# Altium schematic sheet MainBoard_V1p0_ANA.SchDoc
size A4; SheetNumber: 4; SheetTotal: 8
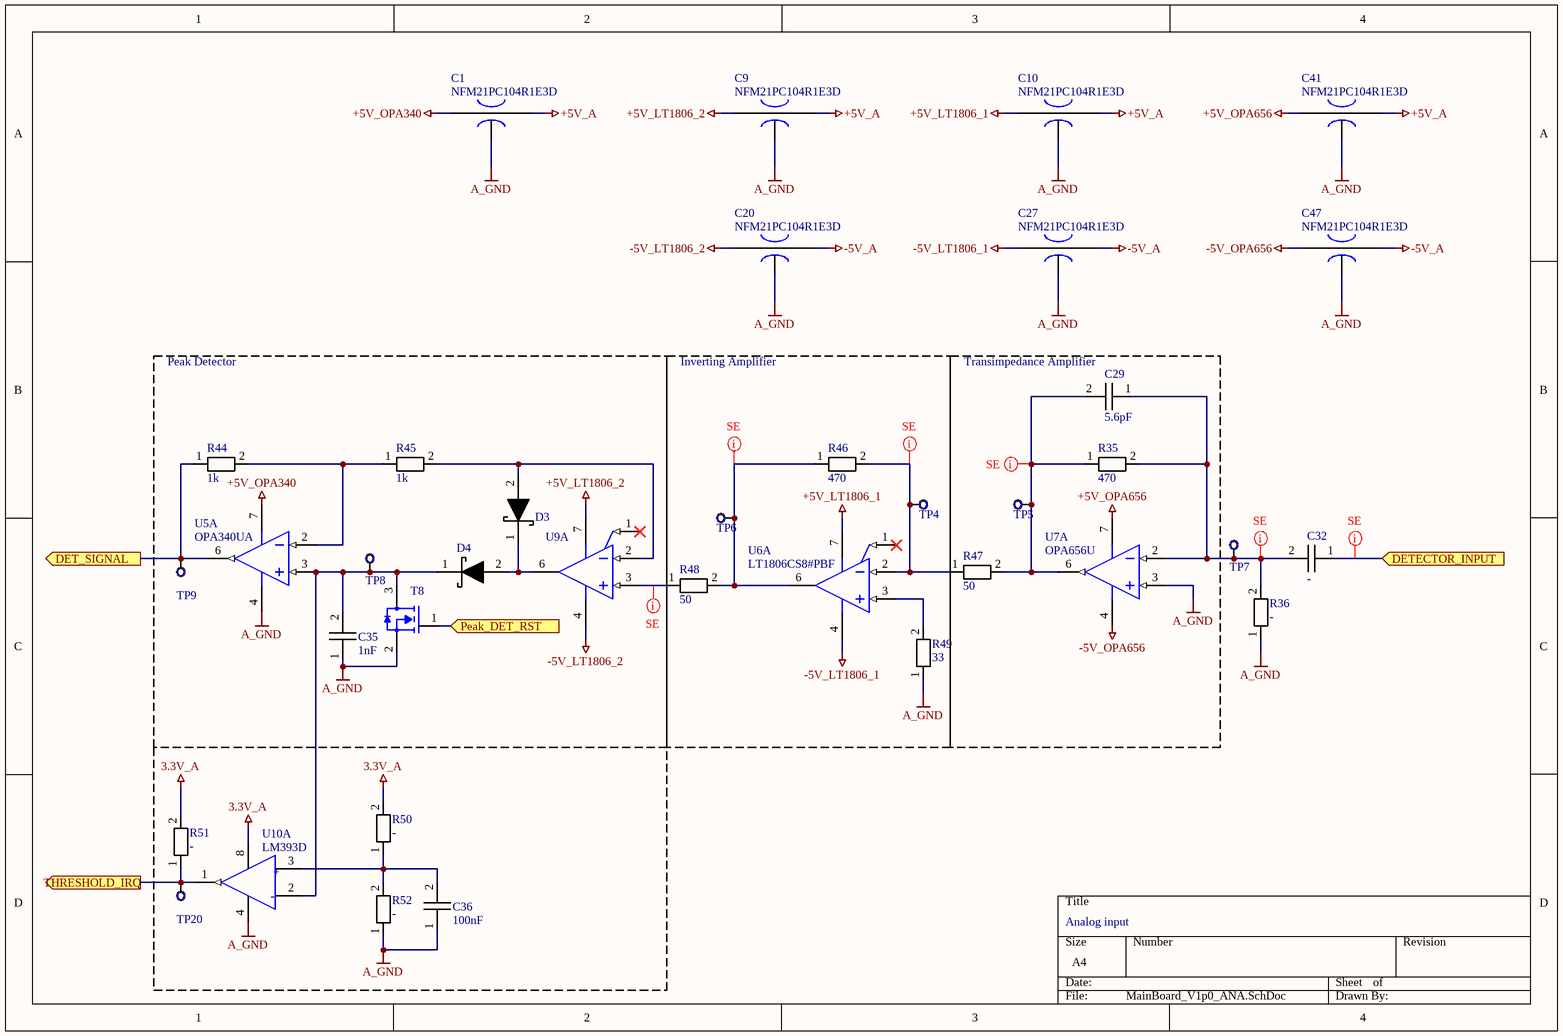
[diagram p0: MainBoard_V1p0_ANA.SchDoc]

## Parts
C1  NFM21PC104R1E3D  [MURATA_NFM21]
C9  NFM21PC104R1E3D  [MURATA_NFM21]
C10  NFM21PC104R1E3D  [MURATA_NFM21]
C20  NFM21PC104R1E3D  [MURATA_NFM21]
C27  NFM21PC104R1E3D  [MURATA_NFM21]
C29  5.6pF  [0805_C]
C32  -  [0805_C]
C35  1nF  [0805_C]
C36  100nF  [0805_C]
C41  NFM21PC104R1E3D  [MURATA_NFM21]
C47  NFM21PC104R1E3D  [MURATA_NFM21]
D3  DIODE_SCHOTTKY  [SMD_DIODE_SOD80]  (value not drawn)
D4  DIODE_SCHOTTKY  [SMD_DIODE_SOD80]  (value not drawn)
R35  470  [0805]
R36  -  [0805]
R44  1k  [0805]
R45  1k  [0805]
R46  470  [0805]
R47  50  [0805]
R48  50  [0805]
R49  33  [0805]
R50  -  [0805]
R51  -  [0805]
R52  -  [0805]
T8  MMBF170  [SOT23]  (value not drawn)
TP4  ?  [PAD_40]  (value not drawn)  (no BOM)
TP5  ?  [PAD_40]  (value not drawn)  (no BOM)
TP6  ?  [PAD_40]  (value not drawn)  (no BOM)
TP7  ?  [PAD_40]  (value not drawn)  (no BOM)
TP8  ?  [PAD_40]  (value not drawn)  (no BOM)
TP9  ?  [PAD_40]  (value not drawn)  (no BOM)
TP20  ?  [PAD_40]  (value not drawn)  (no BOM)
U5  OPA340UA  [SO-8]  (part A of 2)
U6  LT1806CS8#PBF  [SO-8]  (part A of 2)
U7  OPA656U  [SO-8]  (part A of 2)
U9  LT1806CS8#PBF  [SO-8]  (value not drawn)  (part A of 2)
U10  LM393D  [SO-8]  (part A of 2)

## Blocks framed on the sheet
Peak Detector: C35 D3 D4 R44 R45 T8 TP8 TP9 U5 U9
Inverting Amplifier: R46 R48 R49 TP4 TP6 U6
Transimpedance Amplifier: C29 R35 R47 TP5 U7

## Ports
DET_SIGNAL (out), DETECTOR_INPUT (in), Peak_DET_RST (in), THRESHOLD_IRQ (out)

## Nets
3.3V_A: R50.2 R51.2 U10.8(Vcc+)
+5V_A: C1.3(OUT) C9.3(OUT) C10.3(OUT) C41.3(OUT)
+5V_LT1806_1: C10.1(IN) U6.7(V+)
+5V_LT1806_2: C9.1(IN) U9.7(V+)
+5V_OPA340: C1.1(IN) U5.7(V+)
+5V_OPA656: C41.1(IN) U7.7(VS+)
-5V_A: C20.3(OUT) C27.3(OUT) C47.3(OUT)
-5V_LT1806_1: C27.1(IN) U6.4(V-)
-5V_LT1806_2: C20.1(IN) U9.4(V-)
-5V_OPA656: C47.1(IN) U7.4(VS-)
A_GND: C1.2(GND) C9.2(GND) C10.2(GND) C20.2(GND) C27.2(GND) C35.1 C36.1 C41.2(GND) C47.2(GND) R36.1 R49.1 R52.1 T8.2(Source) U5.4(V-) U7.3(IN+) U10.4(Vcc-)
DET_SIGNAL: R44.1 TP9.1 U5.6(OUT) ; port DET_SIGNAL
DETECTOR_INPUT: C32.1 ; port DETECTOR_INPUT
Peak_DET_RST: T8.1(Gate) ; port Peak_DET_RST
THRESHOLD_IRQ: R51.1 TP20.1 U10.1(Out1) ; port THRESHOLD_IRQ
NetC29_1: C29.1 C32.2 R35.2 R36.2 TP7.1 U7.2(IN-)
NetC29_2: C29.2 R35.1 R47.2 TP5.1 U7.6(OUT)
NetC35_2: C35.2 D4.1 T8.3(Drain) TP8.1 U5.3(IN+) U10.2(In1-)
NetC36_2: C36.2 R50.1 R52.2 U10.3(In1+)
NetD3_1: D3.1 D4.2 U9.6(OUT)
NetD3_2: D3.2 R45.2 U9.2(-IN)
NetR44_2: R44.2 R45.1 U5.2(IN-)
NetR46_1: R46.1 R48.2 TP6.1 U6.6(OUT)
NetR46_2: R46.2 R47.1 TP4.1 U6.2(-IN)
NetR48_1: R48.1 U9.3(+IN)
NetR49_2: R49.2 U6.3(+IN)

Not connected (* = marked no-connect by the designer): U6 1(~{SHDN})*; U9 1(~{SHDN})*

## Layout directives
net class SINGLE50: DETECTOR_INPUT, NetC29_1, NetC29_2, NetR46_1, NetR46_2, NetR48_1

## Notes on the sheet
- Analog input
- (in symbol LM393D, part A) +; -

## Library data of the parts
C1 C9 C10 C20 C27 C41 C47 = EMIFIL_CAP: NFM21PC104R1E3D / 100nF/25V
C29 C32 C35 C36 = CAPACITOR
R35 R36 R44-R52 = RESISTOR: Parameter 1: 10k
T8 = MMBF170: N MOSFET
TP4-TP9 TP20 = TESTPOINT
U5 = OPA340UA: Single-Supply, Rail-to-Rail Operational Amplifier MicroAmplifier(TM) Series, 2.7 to 5.5 V, -40 to 85 degC, 8-pin SOIC (D8), Green (RoHS & no Sb/Br); Manufacturer: Texas Instruments; Vio (25C)(Max)(mV): 0.5; Sub Family: Low Input Bias Current Amp (<=10pA), Low Offset Voltage Amplifier (<=500uV), Low Supply Voltage Amplifier (<=2.7V), Precision Amplifier; Vn at 1kHz(Typ)(nV/rtHz): 25; Number of Channels: 1; Offset Drift(Typ)(uV/C): 2.5; Total Supply Voltage(Min)(+5V is 5, +/-5V is 10): 2.7; Slew Rate(Typ)(V/us): 6; Total Supply Voltage(Max)(+5V is 5, +/-5V is 10): 5.5; Iq per channel(Max)(mA): 0.95; CMRR(Min)(dB): 80; IIB(Max)(pA): 10; Code_JEDEC: MS-012; PackageDescription: 8-Pin Plastic Small Outline, Body 4.9 x 3.9 mm, Pitch 1.27 mm; ComponentLink3Description: Package Specification; ComponentLink1Description: Manufacturer URL; DatasheetVersion: SBOS073B; PackageReference: D0008A; PackageVersion: 4040047-3/M, 06/2011; ComponentLink3URL: http://www.ti.com/litv/pdf/msoi002j; ComponentLink1URL: http://www.ti.com/; Mounting Technology: Surface Mount; ComponentLink2URL: http://www.ti.com/general/docs/lit/getliterature.tsp?genericPartNumber=OPA340&fileType=pdf; PartNumber: OPA340UA; ComponentLink2Description: Datasheet; Eco-Plan: Green (RoHS & no Sb/Br)
U6 U9 = LT1806: Single Channel, High Speed, Low Noise Precision Operational Amplifier, 325 MHz Typical GBW, 125 V/us Typical SR, 2.5 to 12.6 V, 8-Pin SOIC (S8-8), Commercial, Pb-Free; Manufacturer: Linear Technology; Is (mA) Typical: 9; GBW (MHz) Typical: 325; SR (V/us) Typical: 125; Vos (mV) Guaranteed: 0.55; Vos (mV) Typical: 0.1; Vs Max (V): 12.6; Vs Min (V): 2.5; Channels (#): 1; DatasheetVersion: Rev. C; ComponentLink3Description: Package Specification; Mounting Technology: Surface Mount; ComponentLink2Description: Datasheet; RevisionNote: URLs updated; PackageDescription: 8-Pin Plastic Small Outline, Body 4.9 x 3.9 mm, Pitch 1.27 mm; PackageVersion: Rev G; RoHS: Pb-Free; Type: VFB; PackageReference: LT-S8-8; ComponentLink2URL: http://cds.linear.com/docs/en/datasheet/18067fc.pdf; Linear Technology Part Number: LT1806; ComponentLink3URL: http://cds.linear.com/docs/en/packaging/05081610_G_SO8.pdf; PartNumber: LT1806CS8#PBF; ComponentLink1Description: Manufacturer URL; ComponentLink1URL: http://www.linear.com/
U7 = OPA656: Wideband, Unity Gain Stable FET-Input Operational Amplifier, 10 to 12 V, -40 to 85 degC, 8-pin SOIC (D8), Green (RoHS & no Sb/Br); Manufacturer: Texas Instruments; BW @ Acl(MHz): 500; Acl, min stable gain(V/V): 1; THD (Fc is 1 MHz)(Typ)(dB): -74; Io(Typ)(mA): 70; @ MHz: 5; Vn at Flatband(Typ)(nV/rtHz): 7; 3rd Harmonic(dBc): 100; Slew Rate(Typ)(V/us): 290; 2nd Harmonic(dBc): 74; Vs(Min)(V): 10; Vs(Max)(V): 12; Iib(Max)(nA): 0.02; Settling Time (0.1%)(Typ)(ns): 16; Vio(Max)(mV): 0.6; Diff Phase(deg): 0.05; Sub Family: High Output Current Amplifier (>=50mA), High Speed Amplifier (>=50MHz), Low Input Bias Current Amp (<=10pA); PartNumber: OPA656U; ComponentLink1URL: http://www.ti.com/; ComponentLink2URL: http://www.ti.com/general/docs/lit/getliterature.tsp?genericPartNumber=OPA656&fileType=pdf; Mounting Technology: Surface Mount; Code_JEDEC: MS-012; PackageReference: D0008A; ComponentLink3URL: http://www.ti.com/litv/pdf/msoi002j; PackageVersion: 4040047-3/M, 06/2011; ComponentLink3Description: Package Specification; Number of Channels: 1; DatasheetVersion: SBOS196G; Iq per channel(Max)(mA): 16; ComponentLink2Description: Datasheet; ComponentLink1Description: Manufacturer URL; Eco-Plan: Green (RoHS & no Sb/Br); Diff Gain(%): 0.02; PackageDescription: 8-Pin Plastic Small Outline, Body 4.9 x 3.9 mm, Pitch 1.27 mm
U10 = LM393D: IC VOLT COMPARATOR DUAL LP 8SOIC; Manufacturer: STMicroelectronics; Response Time: 1.3us; Min Supply Voltage: 2V; Input Offset Voltage: 1mV; Input Bias Current: 0.02uA; Max Dual Supply Voltage: 18V; Output Current Per Channel: 18mA; Max Junction Temp: +150°C; Standoff Height: 0.1mm; Number Of Channels: 2; Nominal Supply Current: 0.45-0.6mA; Voltage Gain: 200V/mV; Max Supply Voltage: 36V; Min Dual Supply Voltage: 1V; Ambient Temperature Range Low: 0°C; ComponentLink2Description: Datasheet; Lead Free: Yes; Device Class L3: Comparators; Device Class L2: Linear ICs; Manufacturer Part Number: LM393D; Digikey Description: IC VOLT COMPARATOR DUAL LP 8SOIC; Category: IC; Octopart: https://octopart.com/lm393d-stmicroelectronics-25832; Package: SO8; RoHS: TRUE; Footprint Url: https://www.st.com/resource/en/datasheet/stm8l001j3.pdf; Temperature Range Low: 0°C; Temperature Range High: +70°C; Mouser Description: Analog Comparators Lo-Pwr Dual Voltage; ComponentLink2URL: https://www.st.com/resource/en/datasheet/lm393.pdf; Automotive: No; Temperature: 0°C to +70°C; Height: 1.75mm; Device Class L1: Integrated Circuits (ICs); Ambient Temperature Range High: +70°C